# EAGLE design EFS_V1 (EAGLE 9.1.3)
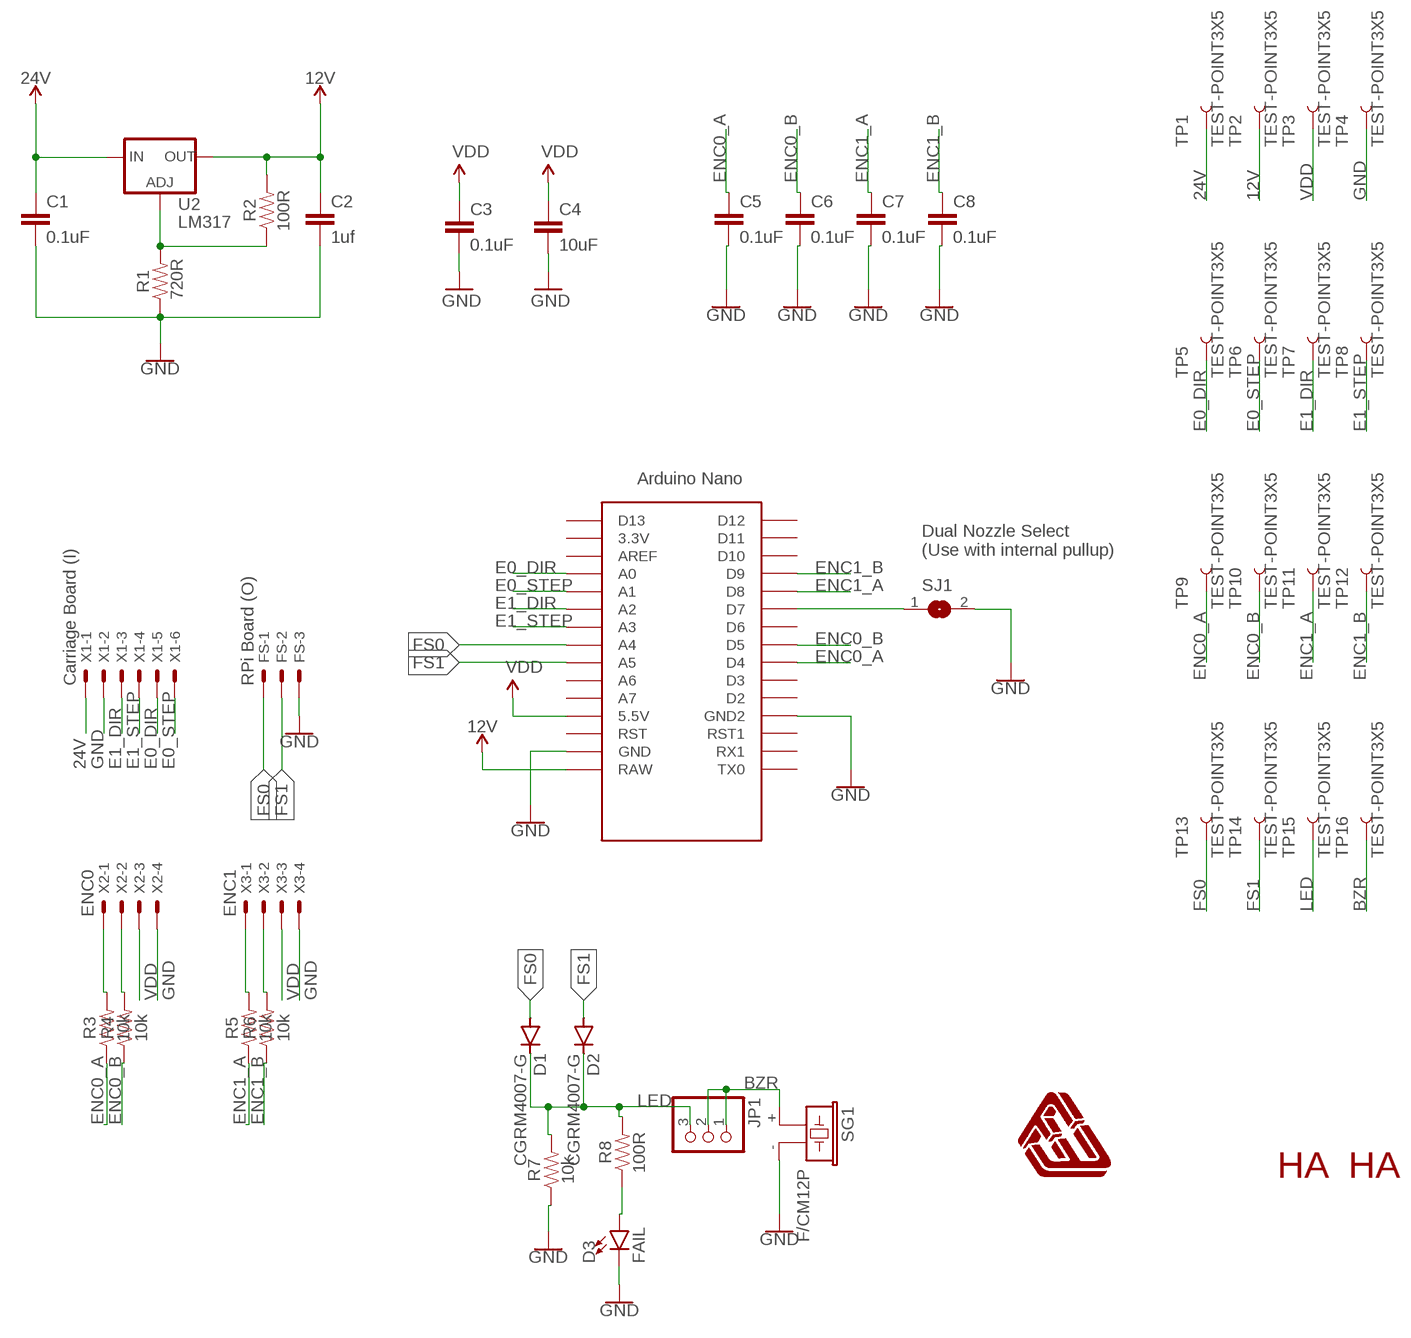
[diagram p0: schematic, sheet 1]

## Parts
C1  0.1uF  9.0PF-0603-50V-10%  [0603]
C2  1uf  9.0PF-0603-50V-10%  [0603]
C3  0.1uF  0.1UF-25V-5%(0603)  [0603-CAP]
C4  10uF  10UF50V20%(1210)  [1210]
C5  0.1uF  9.0PF-0603-50V-10%  [0603]
C6  0.1uF  9.0PF-0603-50V-10%  [0603]
C7  0.1uF  9.0PF-0603-50V-10%  [0603]
C8  0.1uF  9.0PF-0603-50V-10%  [0603]
D1  CGRM4007-G  [SOD-123_MINI-SMA]
D2  CGRM4007-G  [SOD-123_MINI-SMA]
D3  FAIL  LED3MM  [LED_3MM]
FS  RPi Board (O)  JST-XH-03-PIN-LONG-PAD  [JST-XH-03-PACKAGE-LONG-PAD]
JP1  PINHD-1X3  [1X03]
M_HA_1  HA_MARK  [HA_MARK]
M_HA_2  HA_MARK  [HA_MARK]
R1  720R  RESISTOR0603  [0603]
R2  100R  RESISTOR0603  [0603]
R3  10k  RESISTOR0603  [0603]
R4  10k  RESISTOR0603  [0603]
R5  10k  RESISTOR0603  [0603]
R6  10k  RESISTOR0603  [0603]
R7  10k  RESISTOR0603  [0603]
R8  100R  RESISTOR0603  [0603]
SG1  F/CM12P  [F/CM12P]
SJ1  SJW  [SJW]
TP1  TEST-POINT3X5  [PAD.03X.05]
TP2  TEST-POINT3X5  [PAD.03X.05]
TP3  TEST-POINT3X5  [PAD.03X.05]
TP4  TEST-POINT3X5  [PAD.03X.05]
TP5  TEST-POINT3X5  [PAD.03X.05]
TP6  TEST-POINT3X5  [PAD.03X.05]
TP7  TEST-POINT3X5  [PAD.03X.05]
TP8  TEST-POINT3X5  [PAD.03X.05]
TP9  TEST-POINT3X5  [PAD.03X.05]
TP10  TEST-POINT3X5  [PAD.03X.05]
TP11  TEST-POINT3X5  [PAD.03X.05]
TP12  TEST-POINT3X5  [PAD.03X.05]
TP13  TEST-POINT3X5  [PAD.03X.05]
TP14  TEST-POINT3X5  [PAD.03X.05]
TP15  TEST-POINT3X5  [PAD.03X.05]
TP16  TEST-POINT3X5  [PAD.03X.05]
U2  LM317  V_REG_317SMD  [SOT223]
U$1  NANO  [NANO]
U$2  FWLOGO  [FWLOGO]
X1  Carriage Board (I)  JST-XH-06-PIN-LONG-PAD  [JST-XH-06-PACKAGE-LONG-PAD]
X2  ENC0  JST-XH-04-PIN-LONG-PAD  [JST-XH-04-PACKAGE-LONG-PAD]
X3  ENC1  JST-XH-04-PIN-LONG-PAD  [JST-XH-04-PACKAGE-LONG-PAD]

## Nets
12V: C2.1 R2.2 TP2.P$1 U2.2(OUT) U$1.RAW
24V: C1.1 TP1.P$1 U2.3(IN) X1.1
ADJ1: R1.2 R2.1 U2.1(ADJ)
BZR: JP1.1 JP1.2 SG1.+ TP16.P$1
E0_DIR: TP5.P$1 U$1.A0 X1.5
E0_STEP: TP6.P$1 U$1.A1 X1.6
E1_DIR: TP7.P$1 U$1.A2 X1.3
E1_STEP: TP8.P$1 U$1.A3 X1.4
ENC0_A: C5.1 R3.1 TP9.P$1 U$1.D4
ENC0_B: C6.1 R4.1 TP10.P$1 U$1.D5
ENC1_A: C7.1 R5.1 TP11.P$1 U$1.D8
ENC1_B: C8.1 R6.1 TP12.P$1 U$1.D9
FS0: D1.A FS.1 TP13.P$1 U$1.A4
FS1: D2.A FS.2 TP14.P$1 U$1.A5
GND: C1.2 C2.2 C3.2 C4.2 C5.2 C6.2 C7.2 C8.2 D3.K(C) FS.3 R1.1 R7.1 SG1.- SJ1.2 TP4.P$1 U$1.GND U$1.GND1(GND2) X1.2 X2.4 X3.4
LED: D1.C D2.C JP1.3 R7.2 R8.2 TP15.P$1
N$1: R3.2 X2.1
N$2: R4.2 X2.2
N$3: R5.2 X3.1
N$4: R6.2 X3.2
N$5: SJ1.1 U$1.D7
N$6: D3.A R8.1
VDD: C3.1 C4.1 TP3.P$1 U$1.5V(5.5V) X2.3 X3.3
Unconnected: U$1.3.3V U$1.A6 U$1.A7 U$1.AREF U$1.D2 U$1.D3 U$1.D6 U$1.D10 U$1.D11 U$1.D12 U$1.D13 U$1.ICSP1 U$1.ICSP2 U$1.ICSP3 U$1.ICSP4 U$1.ICSP5 U$1.ICSP6 U$1.RST U$1.RST1 U$1.RX1 U$1.TX0

## Notes on the sheet
- Dual Nozzle Select
  (Use with internal pullup)

## Library data of the parts
C1 C2 C5-C8 = SparkFun-Capacitors:9.0PF: 9.0pF ceramic capacitors A capacitor is a passive two-terminal electrical component used to store electrical energy temporarily in an electric field.; PROD_ID: CAP-09341; VALUE: 9.0pF
C3 = SparkFun-Capacitors:0.1UF-25V-5%(0603): CAP-08604; PROD_ID: CAP-08604
C4 = SparkFun-Capacitors:10UF50V20%(1210): CAP-09824; PROD_ID: CAP-09824
D1 D2 = diode:CGRM400*-G: Molded plasitc,JEDEC SOD-123/Mini SMA Source: Comchip CGRM4001-G.pdf
D3 = SparkFun-LED:LED: LED (Generic) Standard schematic elements and footprints for 5mm, 3mm, 1206, and 0603 sized LEDs. Generic LEDs with no color specified.; PROD_ID: DIO-08794
FS = Rembrandt:JST-XH-03-PIN: JST XH Connector 2 Pin Wire to board connector. Pitch: 2,54 mm, (0.100") Number of pins: 3 Created by Rembrandt Electronics www.rembrandtelectronics.com
JP1 = pinhead:PINHD-1X3: PIN HEADER
M_HA_1 M_HA_2 = FracktalWorks:HA_MARK: Maker mark
R1-R8 = SparkFun-Resistors:RESISTOR: Generic Resistor Package
SG1 = buzzer:F/CM12P: BUZZER Source: Buerklin; OC_FARNELL: unknown; OC_NEWARK: unknown
SJ1 = jumper:SJ: SMD solder JUMPER
TP1-TP16 = SparkFun-Connectors:TEST-POINT: SparkFun Test Points Bare copper test points for troubleshooting or In-Circuit-Testing. These are used by our Production team for verifying production board runs using pogo-pins on test beds. SparkFun Products: SparkFun LSM9DS1 Breakout <https://www.sparkfun.com/products/13284> SparkFun PSOC <https://www.sparkfun.com/products/13714> SparkFun Load Cell Amplifier <https://www.sparkfun.com/products/13879>
U2 = SparkFun-IC-Power:V_REG_317: Voltage Regulator Standard LM317 adjustable voltage regulator. AOI (Adjust Output Input). Google 'LM317 Calculator' for easy to use app to get the two resistor values needed. 240/720 for 5V output. 240/390 for 3.3V output. Spark Fun Electronics SKU : COM-00527
U$1 = Arduino-clone:NANO: Arduino Nano
U$2 = FracktalWorks:FWLOGO
X1 = Rembrandt Electronics - JST XH Connectors v1-0:JST-XH-06-PIN: JST XH Connector 2 Pin Wire to board connector. Pitch: 2,54 mm, (0.100") Number of pins: 6 Created by Rembrandt Electronics www.rembrandtelectronics.com
X2 X3 = Rembrandt:JST-XH-04-PIN: JST XH Connector 2 Pin Wire to board connector. Pitch: 2,54 mm, (0.100") Number of pins: 4 Created by Rembrandt Electronics www.rembrandtelectronics.com

## Board
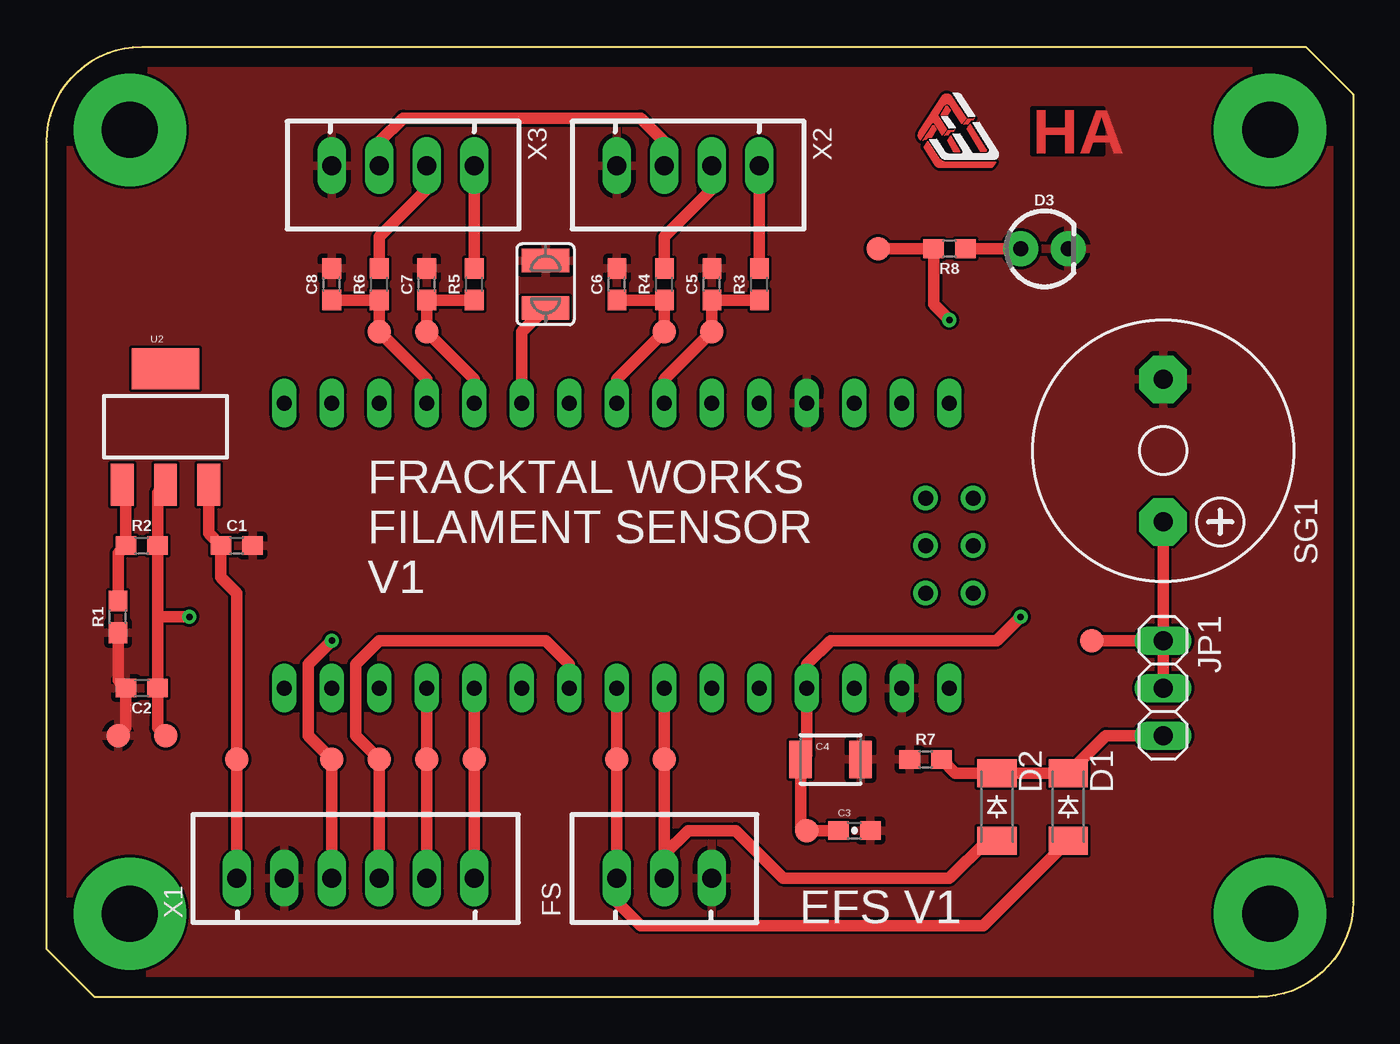
[diagram p1: board, top side]
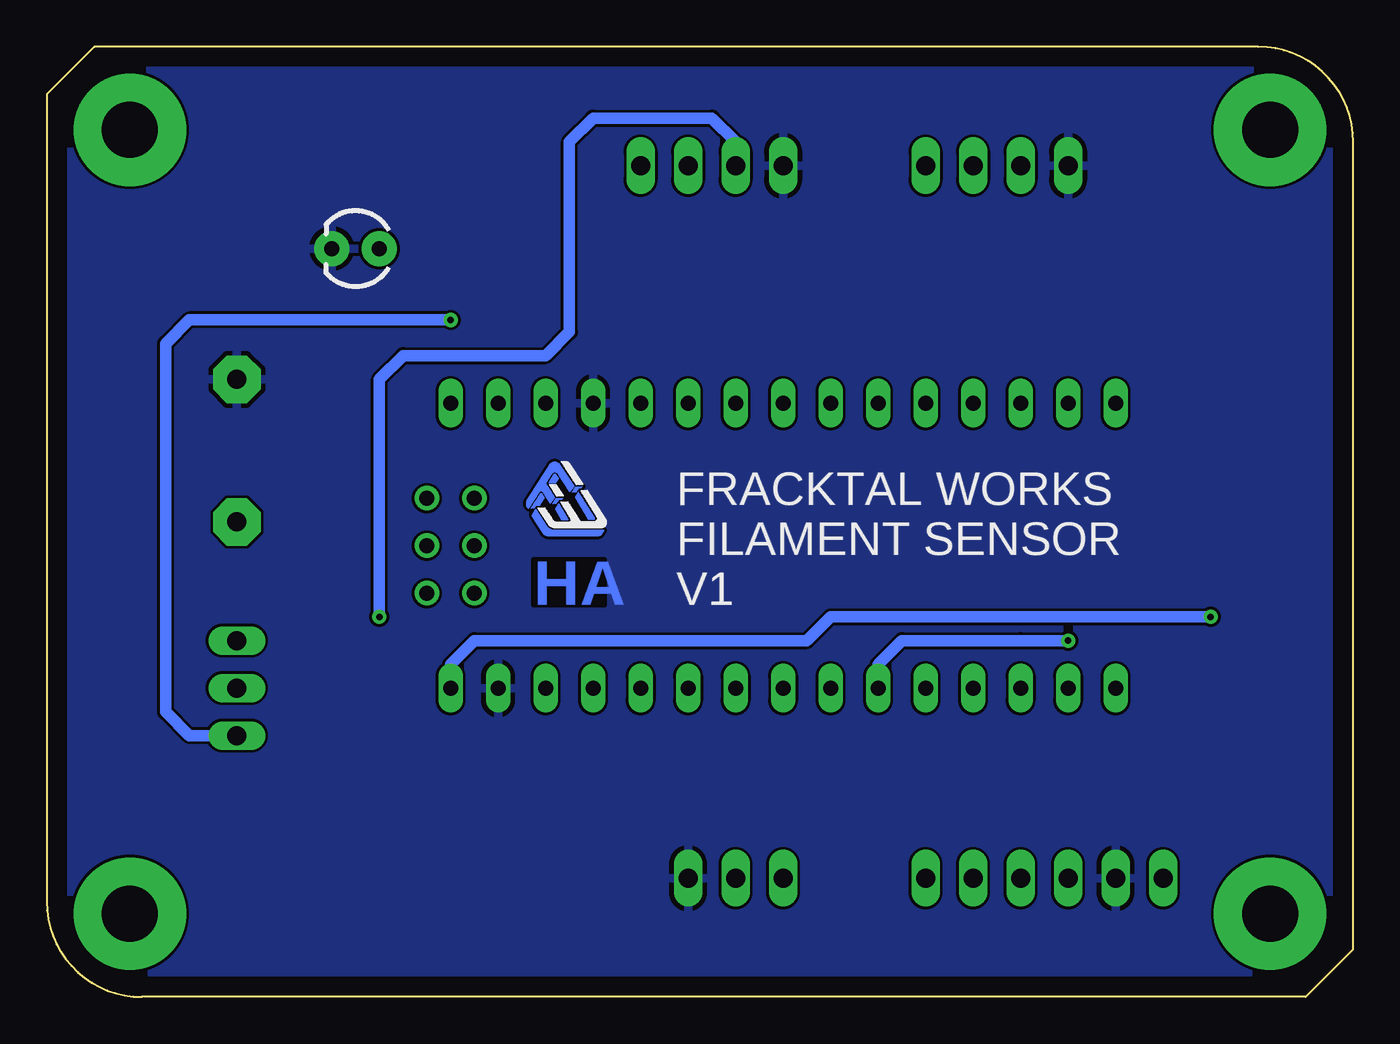
[diagram p2: board, bottom side, seen from below]

Size 69.85 x 50.8 mm. Coordinates in mm from the lower left corner, seen from the top.
Outline: 0,45.72 arc-90 5.08,50.8 67.31,50.8 69.85,48.26 69.85,5.08 arc-90 64.77,0 2.54,0 0,2.54 0,45.72
Copper layers (1*16): Top 0.035mm / dielectric 1.5mm / Bottom 0.035mm
Design rules "default": minimum track width 6mil, minimum drill 0.35mm, track to track 6mil, track to pad 6mil, pad to pad 6mil, via to via 6mil, smd to smd 6mil, copper to edge 40mil, drill to drill 6mil, minimum pad ring 10mil, minimum via ring 8mil, stop-mask expansion 4mil, vias tented up to drill 0mil, thermal gap 10mil

### Footprints (pad centres in the part's own frame; a part is rotated, then mirrored left to right if it is on the bottom)
0603 = smd 1.1 x 1: 1 -0.85,0; 2 0.85,0
0603-CAP = smd 1.1 x 1: 1 -0.85,0; 2 0.85,0
1210 = smd 1.2 x 2: 1 -1.6,0; 2 1.6,0
SOD-123_MINI-SMA = smd 1.5 x 2.1: A 1.8,0; C -1.8,0
LED_3MM = drill 0.813 pad 1.88: A -1.27,0; K 1.27,0
JST-XH-03-PACKAGE-LONG-PAD = drill 1.016 long: 1 -2.54,0; 2 0,0; 3 2.54,0
1X03 = drill 1.016 long: 1 -2.54,0; 2 0,0; 3 2.54,0
F/CM12P = drill 1.016 pad 2.54 octagon: + 3.81,0; - -3.81,0
SJW = smd 1.27 x 2.54: 1 -1.27,0; 2 1.27,0
PAD.03X.05 = smd 1.27 x 1.27: P$1 0,0
SOT223 = smd 1.219 x 2.235: 1 -2.311,-3.099; 2 0,-3.099; 3 2.311,-3.099 | smd 3.6 x 2.2: 4 0,3.099
NANO = drill 0.8 long: 3.3V -10.16,24.13; 5V -10.16,-1.27; A0 -10.16,19.05; A1 -10.16,16.51; A2 -10.16,13.97; A3 -10.16,11.43; A4 -10.16,8.89; A5 -10.16,6.35; A6 -10.16,3.81; A7 -10.16,1.27; AREF -10.16,21.59; D2 5.08,1.27; D3 5.08,3.81; D4 5.08,6.35; D5 5.08,8.89; D6 5.08,11.43; D7 5.08,13.97; D8 5.08,16.51; D9 5.08,19.05; D10 5.08,21.59; D11 5.08,24.13; D12 5.08,26.67; D13 -10.16,26.67; GND -10.16,-6.35; GND1 5.08,-1.27; RAW -10.16,-8.89; RST -10.16,-3.81; RST1 5.08,-3.81; RX1 5.08,-6.35; TX0 5.08,-8.89 | drill 0.8: ICSP1 -5.08,-10.16; ICSP2 -5.08,-7.62; ICSP3 -2.54,-10.16; ICSP4 -2.54,-7.62; ICSP5 0,-10.16; ICSP6 0,-7.62
JST-XH-06-PACKAGE-LONG-PAD = drill 1.016 long: 1 -6.35,0; 2 -3.81,0; 3 -1.27,0; 4 1.27,0; 5 3.81,0; 6 6.35,0
JST-XH-04-PACKAGE-LONG-PAD = drill 1.016 long: 1 -3.81,0; 2 -1.27,0; 3 1.27,0; 4 3.81,0

### Placement (x,y rotation side)
C1  10.16,24.13 0 top
C2  5.08,16.51 180 top
C3  43.18,8.89 0 top
C4  41.91,12.7 0 top
C5  35.56,38.1 90 top
C6  30.48,38.1 90 top
C7  20.32,38.1 90 top
C8  15.24,38.1 90 top
D1  54.61,10.16 270 top
D2  50.8,10.16 270 top
D3  53.34,40.01 0 top
FS  33.02,6.35 0 top
JP1  59.69,16.51 270 top
M_HA_1  52.7,45.09 0 top
M_HA_2  43.81,20.95 0 bottom
R1  3.81,20.32 90 top
R2  5.08,24.13 0 top
R3  38.1,38.1 90 top
R4  33.02,38.1 90 top
R5  22.86,38.1 90 top
R6  17.78,38.1 90 top
R7  46.99,12.7 0 top
R8  48.26,40.01 180 top
SG1  59.69,29.21 270 top
SJ1  26.67,38.1 90 top
TP1  10.16,12.7 90 top
TP2  6.35,13.97 90 top
TP3  40.64,8.89 90 top
TP4  3.81,13.97 90 top
TP5  20.32,12.7 90 top
TP6  22.86,12.7 90 top
TP7  15.24,12.7 90 top
TP8  17.78,12.7 90 top
TP9  35.56,35.56 90 top
TP10  33.02,35.56 90 top
TP11  20.32,35.56 90 top
TP12  17.78,35.56 90 top
TP13  30.48,12.7 90 top
TP14  33.02,12.7 90 top
TP15  44.45,40.01 90 top
TP16  55.88,19.05 90 top
U2  6.35,30.48 0 top
U$1  39.37,26.67 90 top
U$2  45.09,43.18 0 top
U$4  FWLOGO  [FWLOGO]  45.72,23.5 0 bottom
X1  16.51,6.35 0 top
X2  34.29,44.45 180 top
X3  19.05,44.45 180 top

### Tracks (layer width: path | path; a pad name or v marks a point on that pad's centre or on a via)
12V  (via drill 0.35)
  Top 0.61: U2.2 5.93,26.96 R2.2 5.93,20.32 | 5.93,20.32 C2.1 5.93,14.39 TP2.P$1 | v7.62,20.32 5.93,20.32
  Bottom 0.61: U$1.RAW 48.26,17.78 46.99,19.05 29.21,19.05 27.94,20.32 v7.62,20.32
24V
  Top 0.61: U2.3 8.66,24.78 C1.1 9.31,22.44 10.16,21.59 TP1.P$1 X1.1
ADJ1
  Top 0.61: R1.2 3.81,23.71 R2.1 4.23,27.19 U2.1
BZR
  Top 0.61: JP1.1 TP16.P$1 | JP1.2 JP1.1 | JP1.1 SG1.+
E0_DIR
  Top 0.61: X1.5 TP5.P$1 U$1.A0
E0_STEP
  Top 0.61: X1.6 TP6.P$1 U$1.A1
E1_DIR  (via drill 0.35)
  Top 0.61: X1.3 TP7.P$1 13.97,13.97 13.97,17.78 v15.24,19.05
  Bottom 0.61: U$1.A2 25.4,17.78 24.13,19.05 17.78,19.05 v15.24,19.05
E1_STEP
  Top 0.61: X1.4 TP8.P$1 16.51,13.97 16.51,17.78 17.78,19.05 26.67,19.05 27.94,17.78 U$1.A3
ENC0_A
  Top 0.61: R3.1 C5.1 TP9.P$1 33.02,33.02 U$1.D4
ENC0_B
  Top 0.61: C6.1 R4.1 TP10.P$1 30.48,33.02 U$1.D5
ENC1_A
  Top 0.61: R5.1 21.59,37.25 C7.1 TP11.P$1 22.86,33.02 U$1.D8
ENC1_B
  Top 0.61: C8.1 R6.1 TP12.P$1 20.32,33.02 U$1.D9
FS0
  Top 0.61: U$1.A4 TP13.P$1 FS.1 30.48,5.08 31.75,3.81 50.06,3.81 D1.A
FS1
  Top 0.61: U$1.A5 TP14.P$1 FS.2 33.02,7.62 34.29,8.89 36.83,8.89 39.37,6.35 48.26,6.35 50.27,8.36 D2.A
GND
  Top 0.61: R1.1 3.81,16.93 C2.2 4.23,14.39 TP4.P$1
  pour Top: -1.27,-1.27 -1.27,52.07 71.12,52.07 71.12,-1.27
  pour Bottom: -2.54,53.34 -2.54,-2.54 72.39,-2.54 72.39,53.34
LED  (via drill 0.35)
  Top 0.61: JP1.3 56.62,13.97 D1.C D2.C 48.58,11.96 R7.2 | TP15.P$1 R8.2 47.41,37.05 v48.26,36.2
  Bottom 0.61: JP1.3 62.23,13.97 63.5,15.24 63.5,34.92 62.23,36.2 v48.26,36.2
N$1
  Top 0.61: R3.2 X2.1
N$2
  Top 0.61: R4.2 33.02,40.64 35.56,43.18 X2.2
N$3
  Top 0.61: R5.2 X3.1
N$4
  Top 0.61: R6.2 17.78,40.64 20.32,43.18 X3.2
N$5
  Top 0.61: SJ1.1 25.4,35.56 U$1.D7
N$6
  Top 0.61: R8.1 D3.A
N$7  (via drill 3 pad 6)
  other vias: 4.45,46.35
N$8  (via drill 3 pad 6)
  other vias: 65.41,46.35
N$9  (via drill 3 pad 6)
  other vias: 4.45,4.45
N$10  (via drill 3 pad 6)
  other vias: 65.41,4.45
VDD  (via drill 0.35)
  Top 0.61: C3.1 TP3.P$1 arc-90 40.31,9.22 C4.1 arc90 40.64,13.03 U$1.5V 40.64,17.78 41.91,19.05 50.8,19.05 v52.07,20.32 | X3.3 17.78,45.72 19.05,46.99 31.75,46.99 33.02,45.72 X2.3
  Bottom 0.61: v52.07,20.32 52.07,33.02 50.8,34.29 43.18,34.29 41.91,35.56 41.91,45.72 40.64,46.99 34.29,46.99 33.02,45.72 X2.3

### Text on the board
tPlace: FRACKTAL WORKS / FILAMENT SENSOR / V1 | EFS V1
bPlace: FRACKTAL WORKS / FILAMENT SENSOR / V1